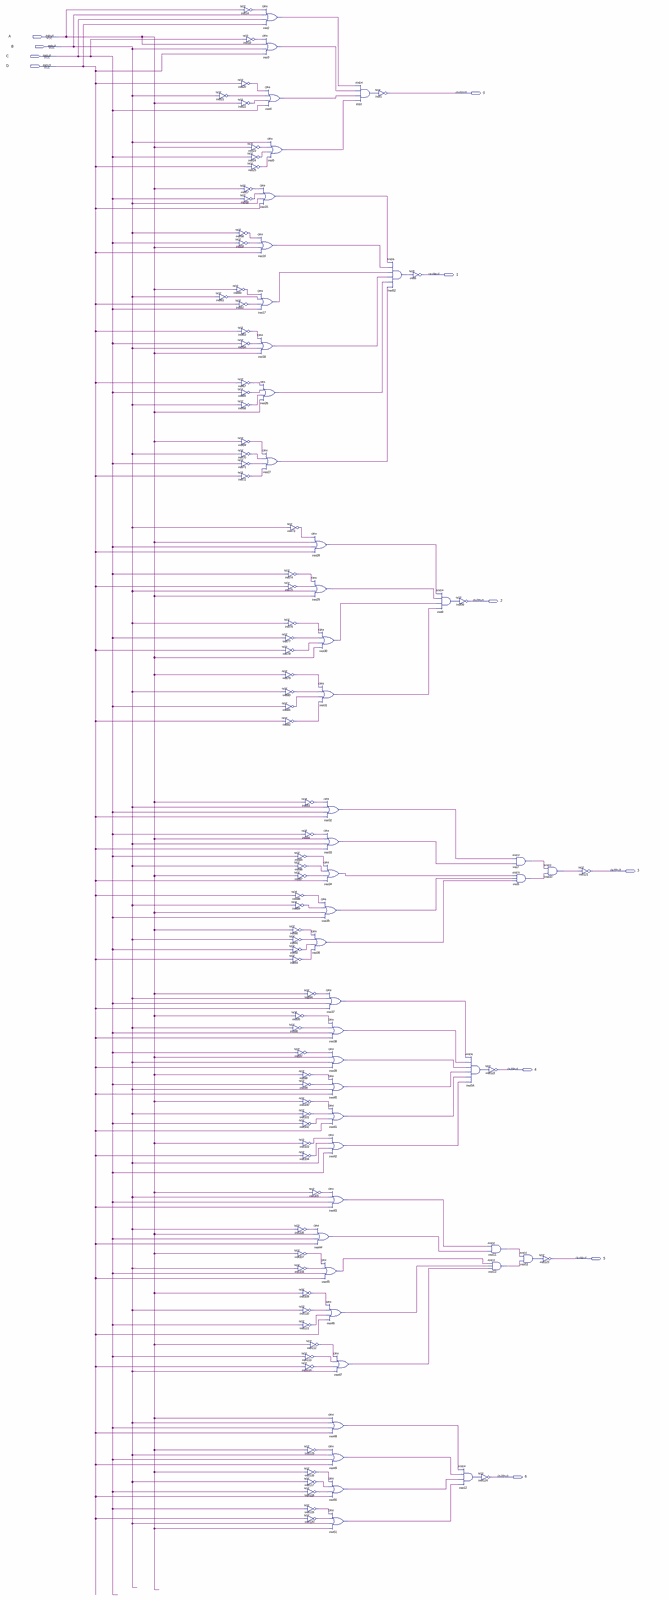
[diagram p0: schematic sheet, whole]
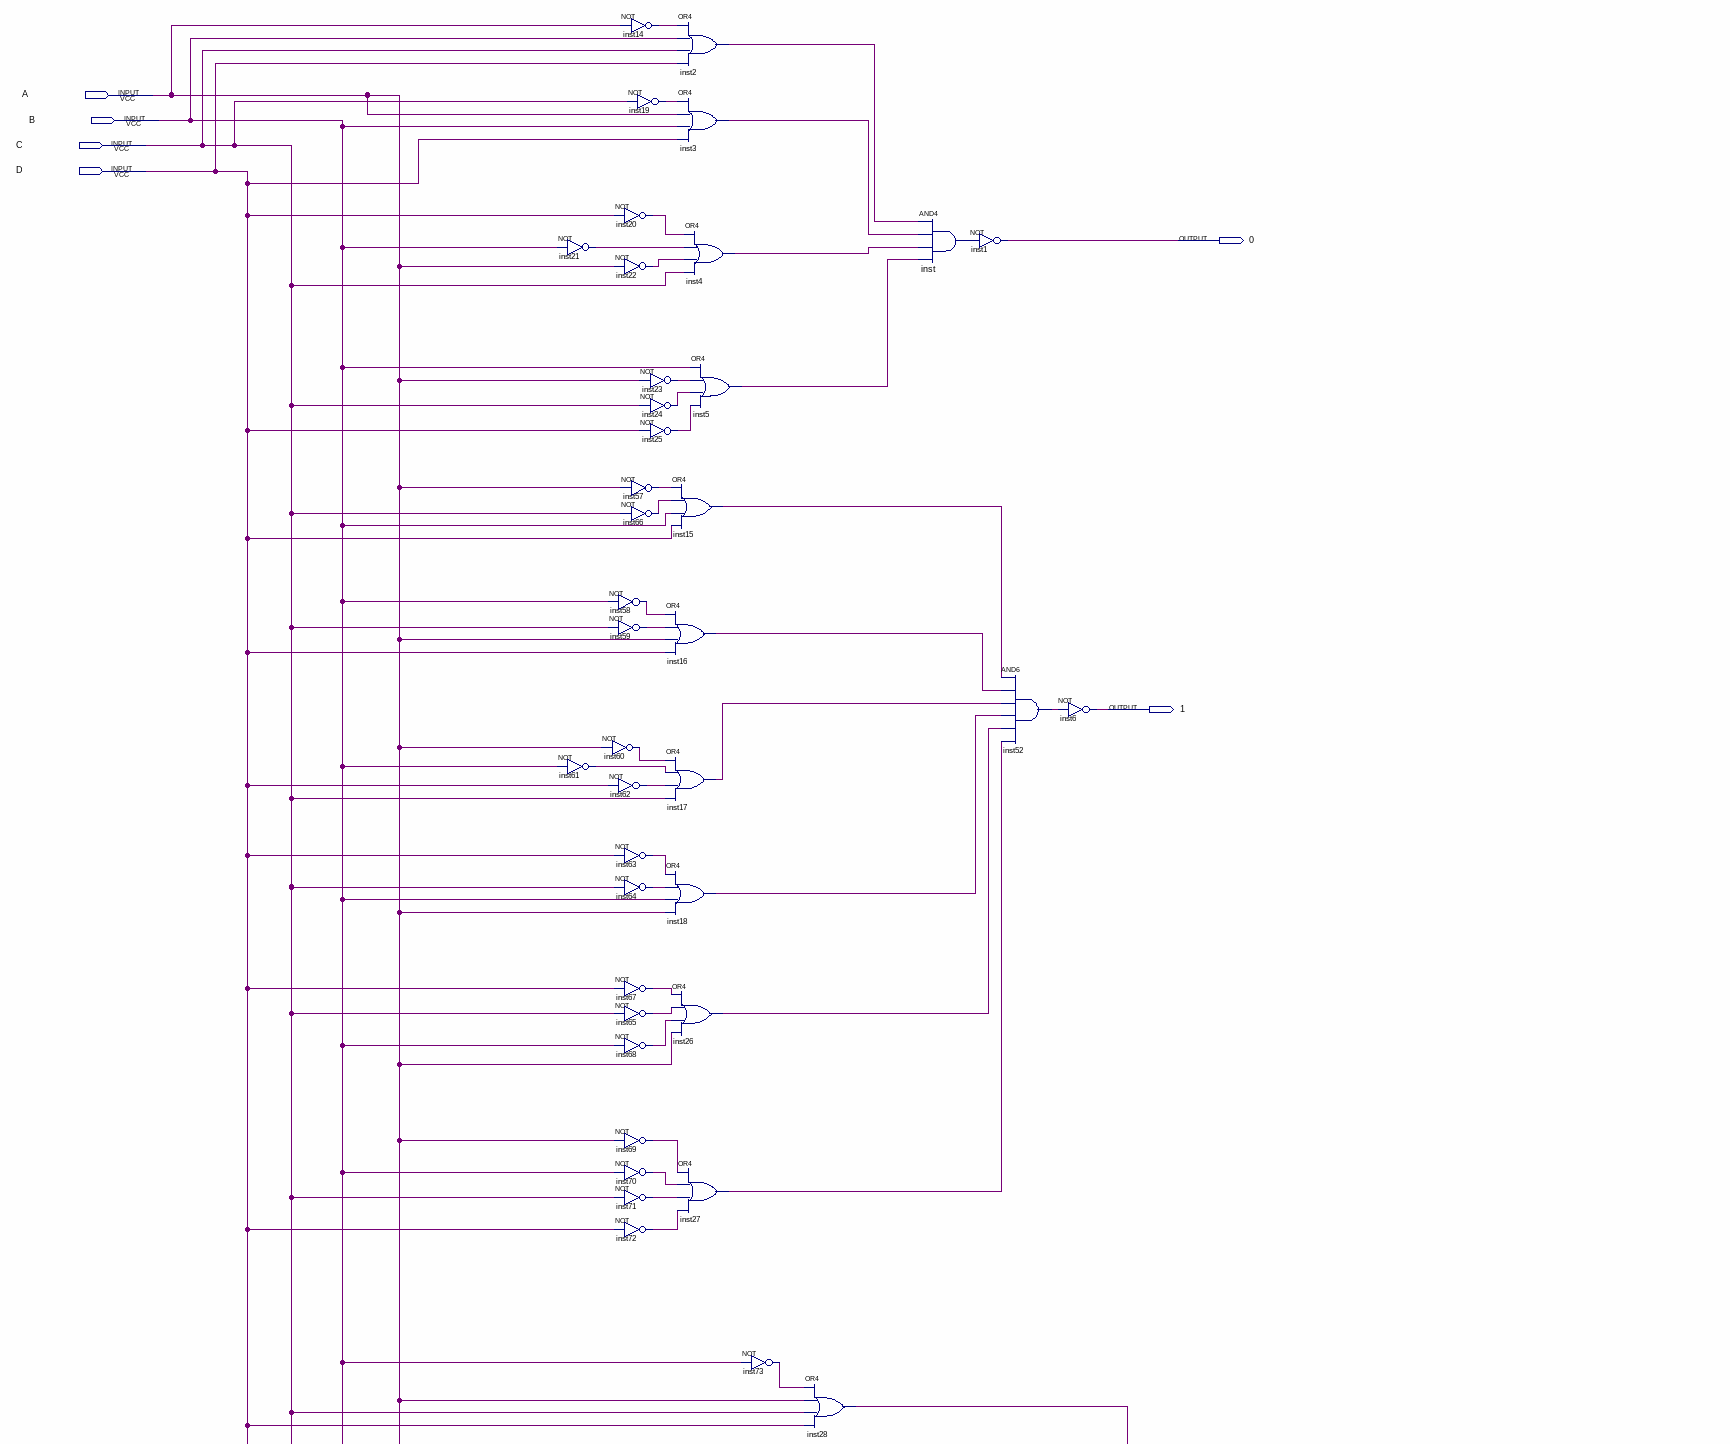
[diagram p1: schematic sheet, upper part]
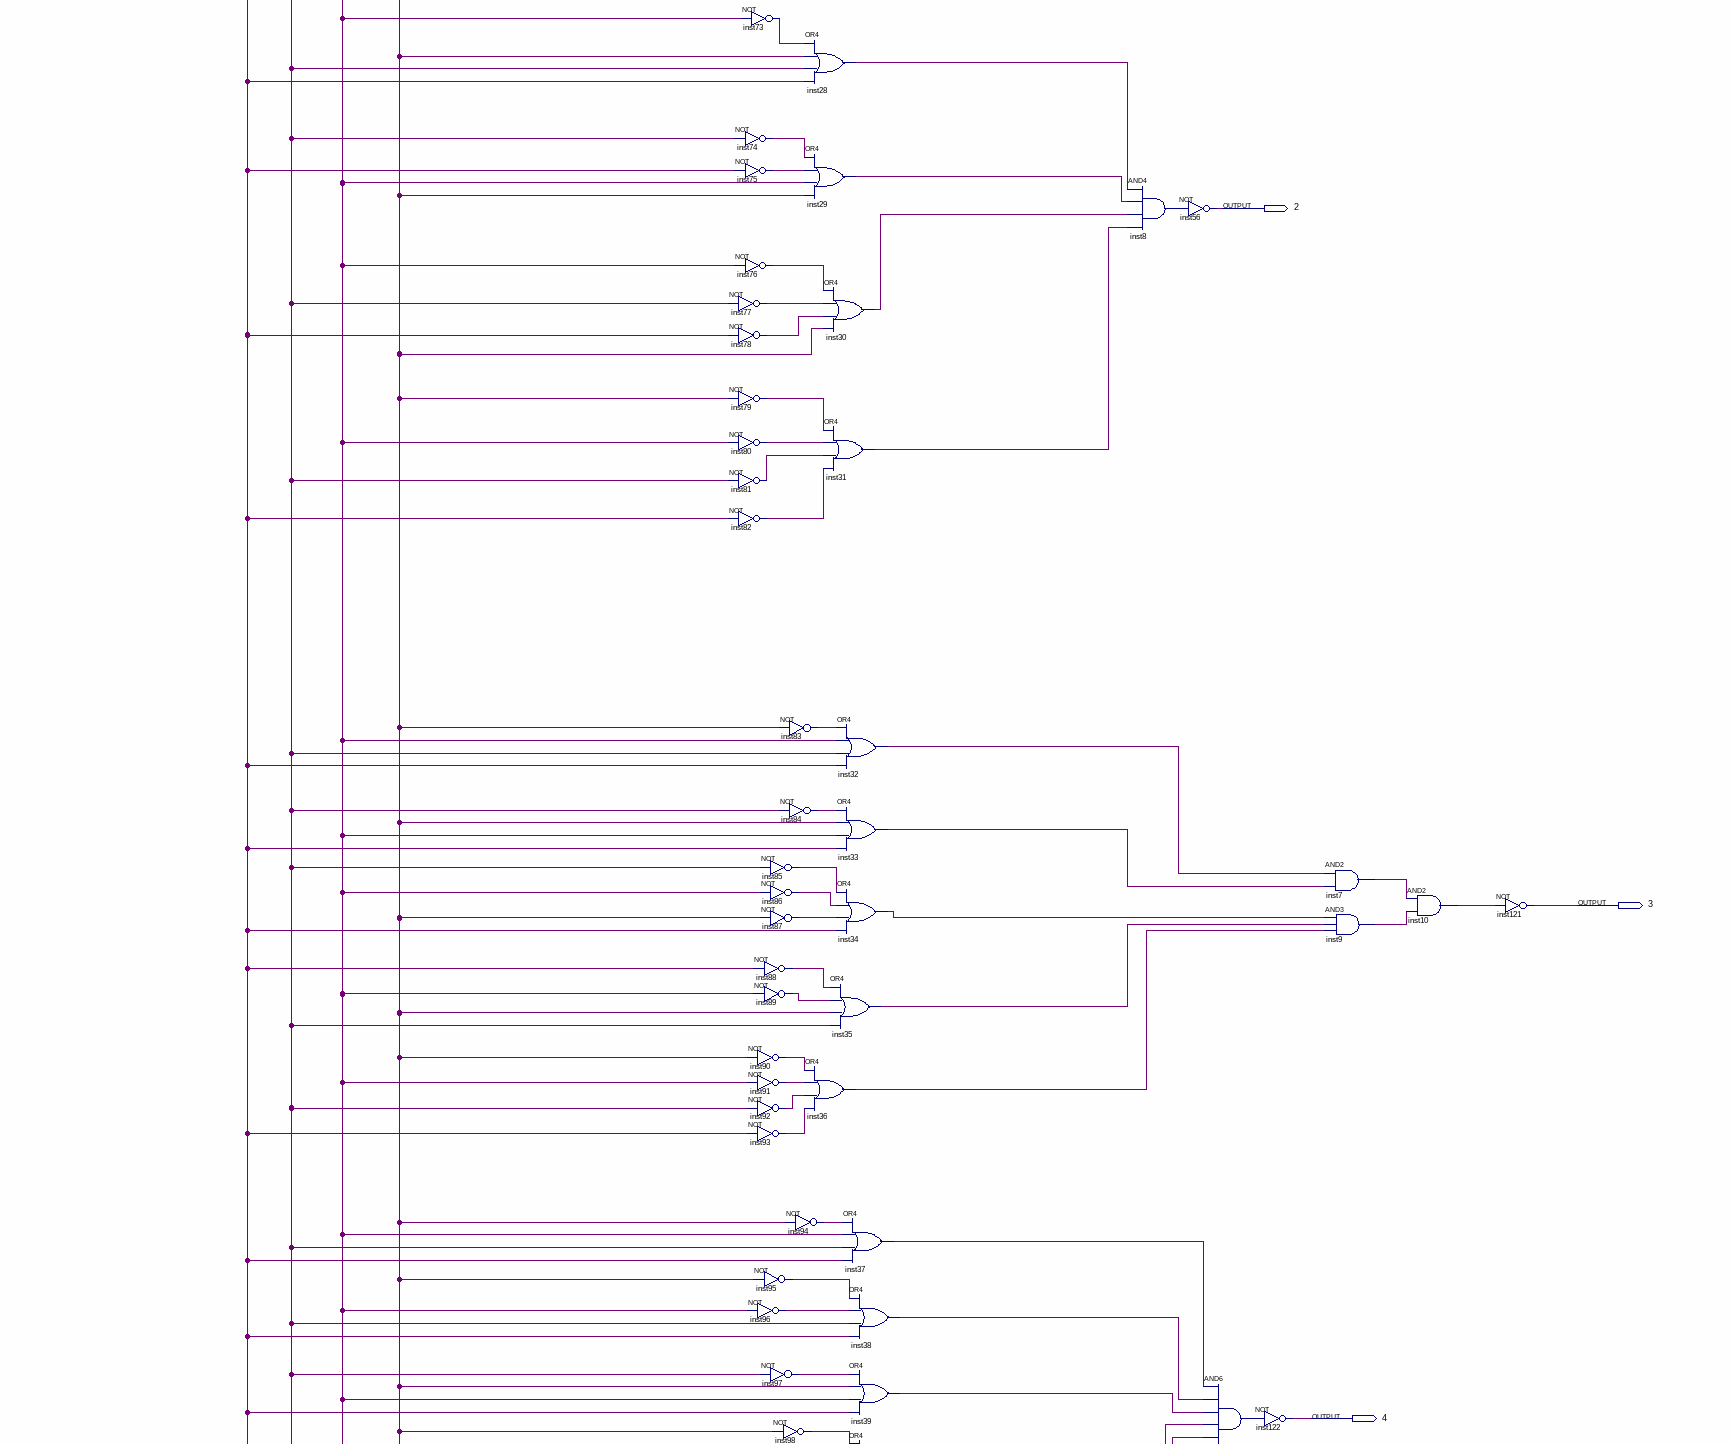
[diagram p2: schematic sheet, middle part]
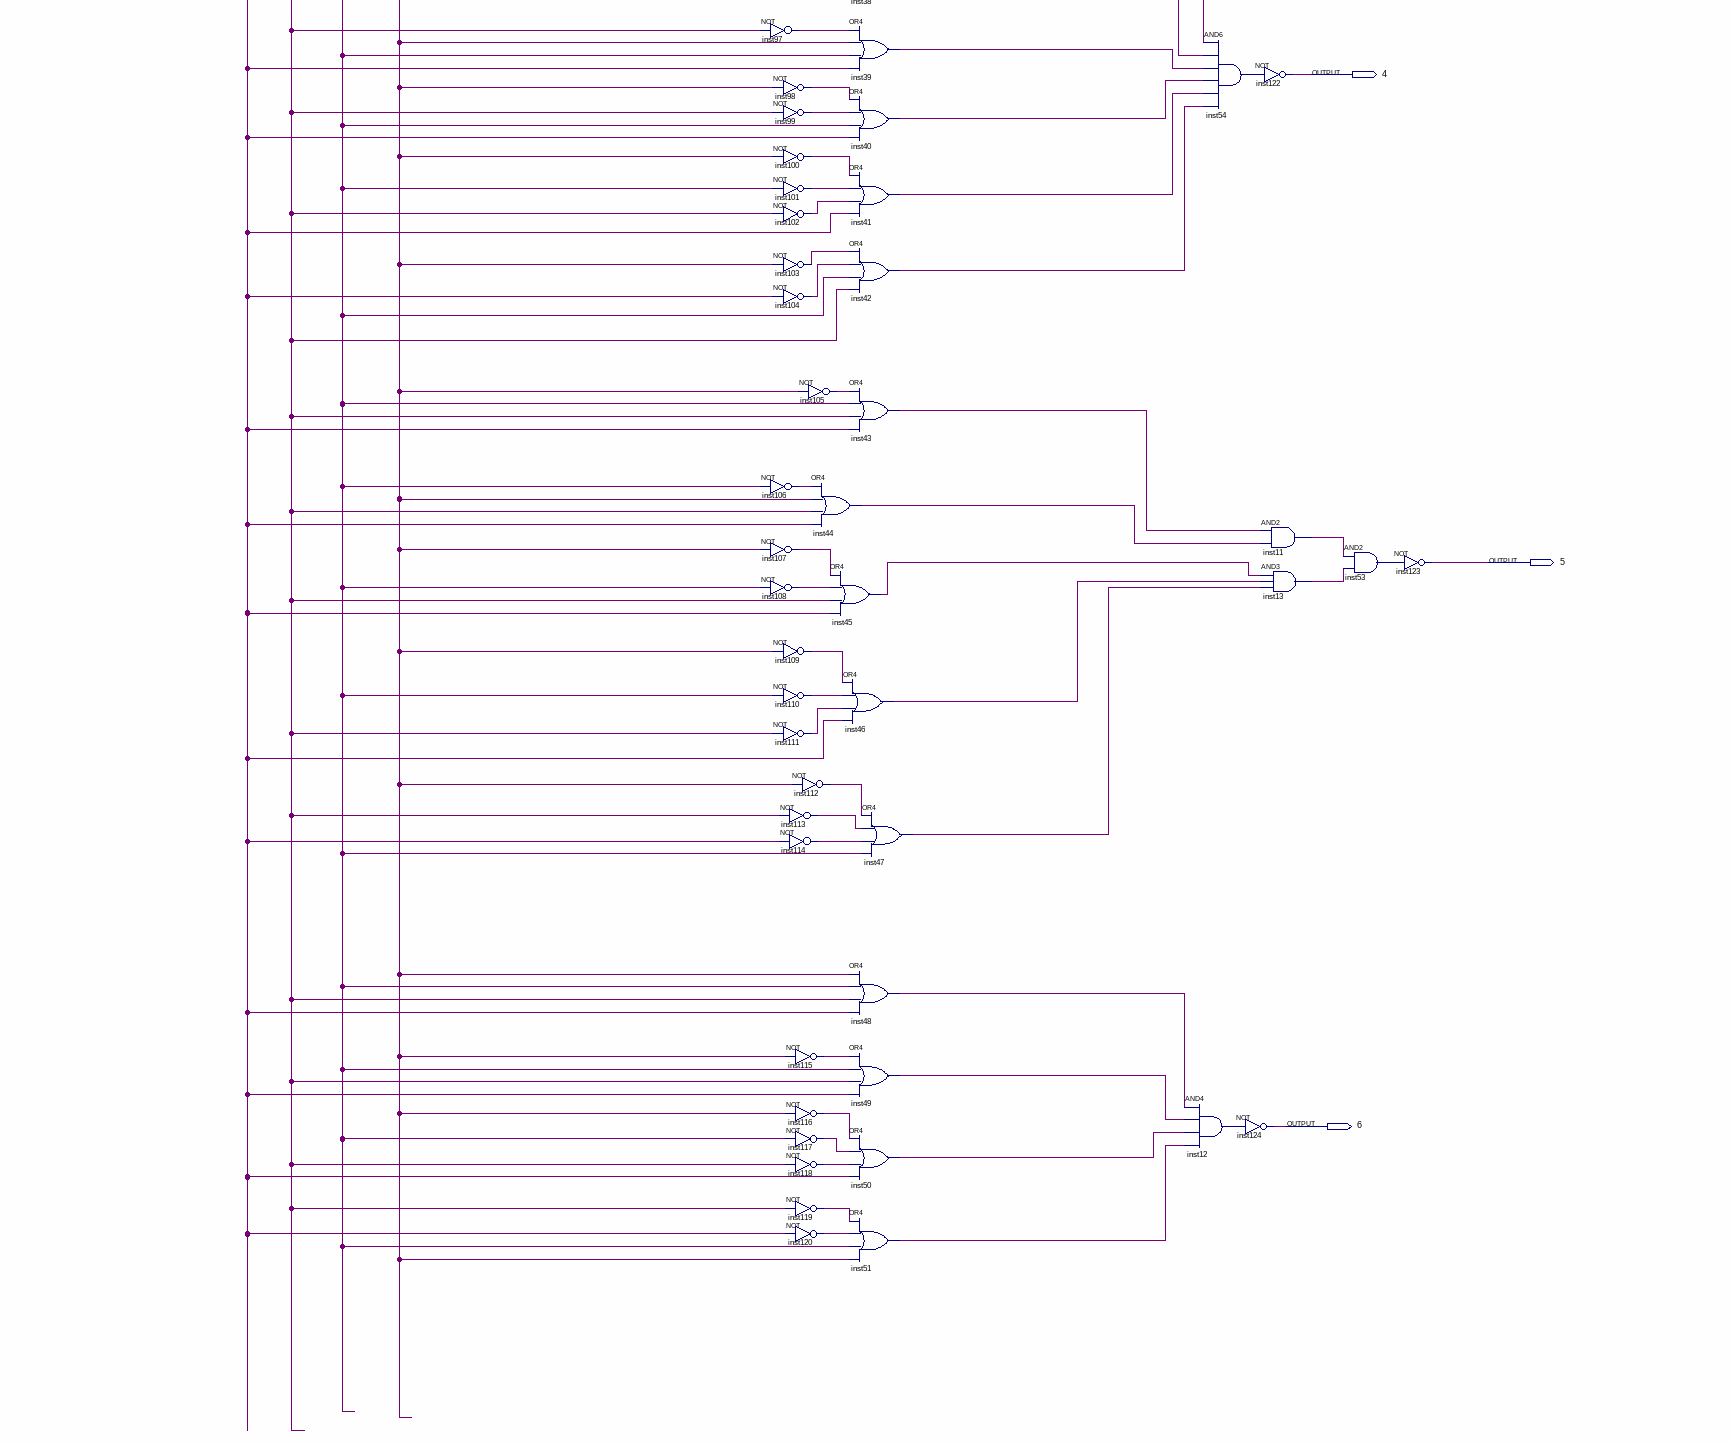
[diagram p3: schematic sheet, lower part]
// Quartus schematic Display.bdf as structural Verilog: 124 symbols, 11 pins
module Display (
  input  A,
  input  B,
  input  C,
  input  D,
  output \0 ,
  output \1 ,
  output \2 ,
  output \3 ,
  output \4 ,
  output \5 ,
  output \6 
);

  wire inst2_out, inst3_out, inst4_out, inst5_out, inst7_out, inst8_out, inst9_out, inst10_out, inst11_out,
       inst12_out, inst13_out, inst14_out, inst15_out, inst16_out, inst17_out, inst18_out, inst19_out,
       inst20_out, inst21_out, inst22_out, inst23_out, inst24_out, inst25_out, inst26_out, inst27_out,
       inst28_out, inst29_out, inst30_out, inst31_out, inst32_out, inst33_out, inst34_out, inst35_out,
       inst36_out, inst37_out, inst38_out, inst39_out, inst40_out, inst41_out, inst42_out, inst43_out,
       inst44_out, inst45_out, inst46_out, inst47_out, inst48_out, inst49_out, inst50_out, inst51_out,
       inst52_out, inst53_out, inst54_out, inst57_out, inst58_out, inst59_out, inst60_out, inst61_out,
       inst62_out, inst63_out, inst64_out, inst65_out, inst66_out, inst67_out, inst68_out, inst69_out,
       inst70_out, inst71_out, inst72_out, inst73_out, inst74_out, inst75_out, inst76_out, inst77_out,
       inst78_out, inst79_out, inst80_out, inst81_out, inst82_out, inst83_out, inst84_out, inst85_out,
       inst86_out, inst87_out, inst88_out, inst89_out, inst90_out, inst91_out, inst92_out, inst93_out,
       inst94_out, inst95_out, inst96_out, inst97_out, inst98_out, inst99_out, inst100_out, inst101_out,
       inst102_out, inst103_out, inst104_out, inst105_out, inst106_out, inst107_out, inst108_out,
       inst109_out, inst110_out, inst111_out, inst112_out, inst113_out, inst114_out, inst115_out,
       inst116_out, inst117_out, inst118_out, inst119_out, inst120_out, inst_out;

  not inst21 (inst21_out, B);
  not inst61 (inst61_out, B);
  not inst14 (inst14_out, A);
  not inst20 (inst20_out, D);
  not inst22 (inst22_out, A);
  not inst57 (inst57_out, A);
  not inst66 (inst66_out, C);
  not inst58 (inst58_out, B);
  not inst59 (inst59_out, C);
  not inst60 (inst60_out, A);
  not inst62 (inst62_out, D);
  not inst63 (inst63_out, D);
  not inst64 (inst64_out, C);
  not inst67 (inst67_out, D);
  not inst65 (inst65_out, C);
  not inst68 (inst68_out, B);
  not inst69 (inst69_out, A);
  not inst70 (inst70_out, B);
  not inst71 (inst71_out, C);
  not inst72 (inst72_out, D);
  not inst19 (inst19_out, C);
  not inst23 (inst23_out, A);
  not inst24 (inst24_out, C);
  not inst25 (inst25_out, D);
  or inst15 (inst15_out, inst57_out, inst66_out, B, D);
  or inst16 (inst16_out, inst58_out, inst59_out, A, D);
  or inst17 (inst17_out, inst60_out, inst61_out, inst62_out, C);
  or inst18 (inst18_out, inst63_out, inst64_out, B, A);
  or inst26 (inst26_out, inst67_out, inst65_out, inst68_out, A);
  or inst2 (inst2_out, inst14_out, B, C, D);
  or inst3 (inst3_out, inst19_out, A, B, D);
  or inst4 (inst4_out, inst20_out, inst21_out, inst22_out, C);
  or inst5 (inst5_out, B, inst23_out, inst24_out, inst25_out);
  or inst27 (inst27_out, inst69_out, inst70_out, inst71_out, inst72_out);
  not inst73 (inst73_out, B);
  not inst74 (inst74_out, C);
  not inst75 (inst75_out, D);
  not inst76 (inst76_out, B);
  not inst77 (inst77_out, C);
  not inst78 (inst78_out, D);
  not inst79 (inst79_out, A);
  not inst80 (inst80_out, B);
  not inst81 (inst81_out, C);
  not inst82 (inst82_out, D);
  not inst85 (inst85_out, C);
  not inst86 (inst86_out, B);
  not inst87 (inst87_out, A);
  not inst88 (inst88_out, D);
  not inst89 (inst89_out, B);
  not inst90 (inst90_out, A);
  not inst91 (inst91_out, B);
  not inst92 (inst92_out, C);
  not inst93 (inst93_out, D);
  not inst95 (inst95_out, A);
  not inst96 (inst96_out, B);
  not inst97 (inst97_out, C);
  not inst98 (inst98_out, A);
  not inst99 (inst99_out, C);
  not inst100 (inst100_out, A);
  not inst101 (inst101_out, B);
  not inst102 (inst102_out, C);
  not inst103 (inst103_out, A);
  not inst104 (inst104_out, D);
  not inst106 (inst106_out, B);
  not inst107 (inst107_out, A);
  not inst108 (inst108_out, B);
  not inst109 (inst109_out, A);
  not inst110 (inst110_out, B);
  not inst111 (inst111_out, C);
  or inst28 (inst28_out, inst73_out, A, C, D);
  or inst29 (inst29_out, inst74_out, inst75_out, B, A);
  or inst30 (inst30_out, inst76_out, inst77_out, inst78_out, A);
  or inst31 (inst31_out, inst79_out, inst80_out, inst81_out, inst82_out);
  not inst83 (inst83_out, A);
  not inst84 (inst84_out, C);
  or inst36 (inst36_out, inst90_out, inst91_out, inst92_out, inst93_out);
  not inst94 (inst94_out, A);
  not inst105 (inst105_out, A);
  or inst44 (inst44_out, inst106_out, A, C, D);
  not inst112 (inst112_out, A);
  not inst113 (inst113_out, C);
  not inst114 (inst114_out, D);
  not inst115 (inst115_out, A);
  not inst116 (inst116_out, A);
  not inst117 (inst117_out, B);
  not inst118 (inst118_out, C);
  not inst119 (inst119_out, C);
  not inst120 (inst120_out, D);
  or inst32 (inst32_out, inst83_out, B, C, D);
  or inst33 (inst33_out, inst84_out, A, B, D);
  or inst34 (inst34_out, inst85_out, inst86_out, inst87_out, D);
  or inst35 (inst35_out, inst88_out, inst89_out, A, C);
  or inst37 (inst37_out, inst94_out, B, C, D);
  or inst38 (inst38_out, inst95_out, inst96_out, C, D);
  or inst39 (inst39_out, inst97_out, A, B, D);
  or inst40 (inst40_out, inst98_out, inst99_out, B, D);
  or inst41 (inst41_out, inst100_out, inst101_out, inst102_out, D);
  or inst42 (inst42_out, inst103_out, inst104_out, B, C);
  or inst43 (inst43_out, inst105_out, B, C, D);
  or inst45 (inst45_out, inst107_out, inst108_out, C, D);
  or inst46 (inst46_out, inst109_out, inst110_out, inst111_out, D);
  or inst47 (inst47_out, inst112_out, inst113_out, inst114_out, B);
  or inst48 (inst48_out, A, B, C, D);
  or inst49 (inst49_out, inst115_out, B, C, D);
  or inst50 (inst50_out, inst116_out, inst117_out, inst118_out, D);
  or inst51 (inst51_out, inst119_out, inst120_out, B, A);
  and inst (inst_out, inst2_out, inst3_out, inst4_out, inst5_out);
  not inst1 (\0 , inst_out);
  and inst52 (inst52_out, inst15_out, inst16_out, inst17_out, inst18_out, inst26_out, inst27_out);
  not inst6 (\1 , inst52_out);
  and inst8 (inst8_out, inst28_out, inst29_out, inst30_out, inst31_out);
  not inst56 (\2 , inst8_out);
  and inst54 (inst54_out, inst37_out, inst38_out, inst39_out, inst40_out, inst41_out, inst42_out);
  and inst12 (inst12_out, inst48_out, inst49_out, inst50_out, inst51_out);
  not inst122 (\4 , inst54_out);
  and inst11 (inst11_out, inst43_out, inst44_out);
  and inst13 (inst13_out, inst45_out, inst46_out, inst47_out);
  not inst124 (\6 , inst12_out);
  and inst7 (inst7_out, inst32_out, inst33_out);
  and inst9 (inst9_out, inst34_out, inst35_out, inst36_out);
  and inst53 (inst53_out, inst11_out, inst13_out);
  and inst10 (inst10_out, inst7_out, inst9_out);
  not inst123 (\5 , inst53_out);
  not inst121 (\3 , inst10_out);
endmodule
